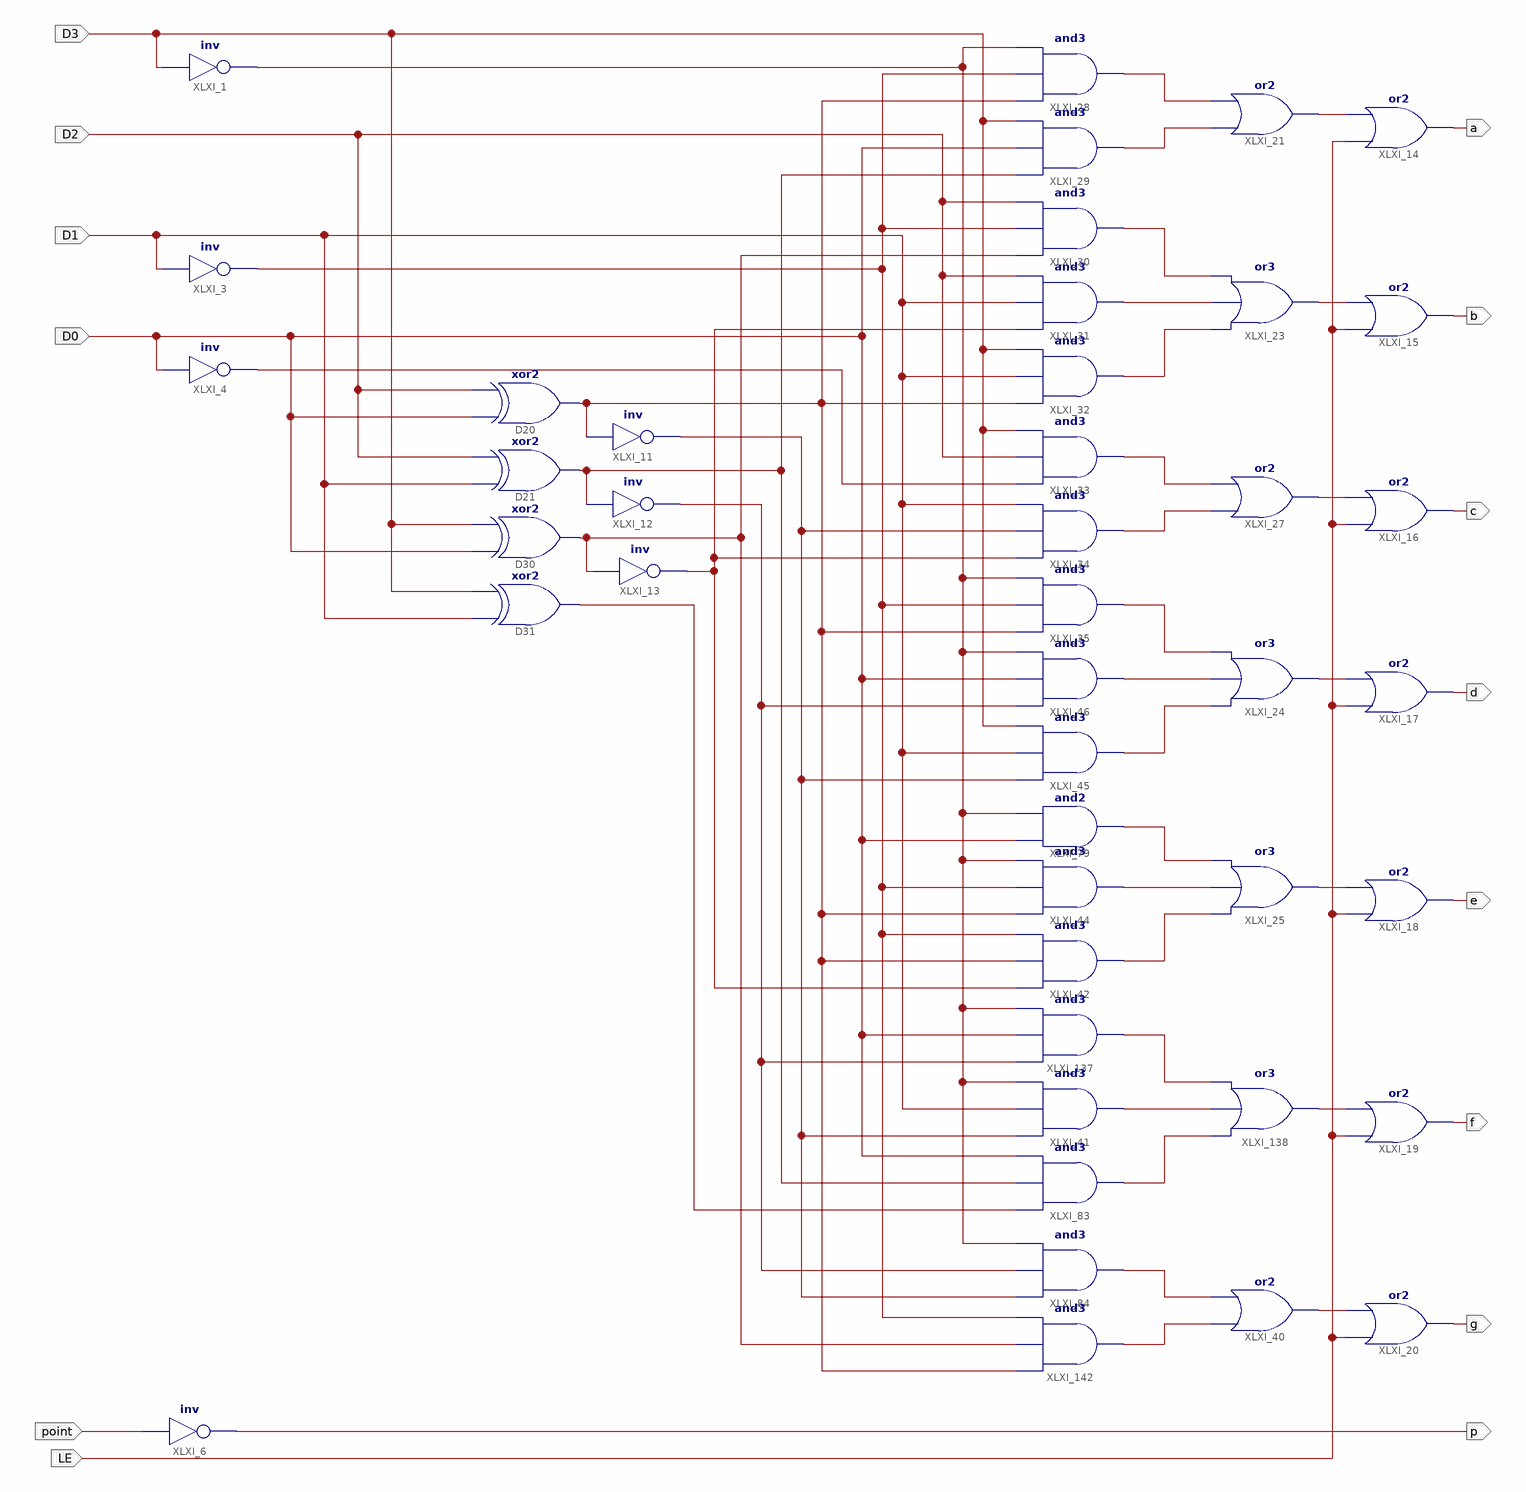
[diagram p0: schematic sheet 1]
// Xilinx ISE schematic MC14495_ZJU.sch (kintex7) as structural Verilog: 43 symbols, 14 ports
module MC14495_ZJU (
  input  D3,
  input  D2,
  input  D0,
  input  point,
  input  LE,
  input  D1,
  output p,
  output b,
  output a,
  output c,
  output d,
  output e,
  output f,
  output g
);

  wire XLXN_22, XLXN_24, XLXN_29, XLXN_31, XLXN_32, XLXN_33, XLXN_35, XLXN_36, XLXN_47, XLXN_48, XLXN_49,
       XLXN_50, XLXN_51, XLXN_68, XLXN_115, XLXN_121, XLXN_122, XLXN_123, XLXN_124, XLXN_125, XLXN_126,
       XLXN_127, XLXN_128, XLXN_129, XLXN_130, XLXN_131, XLXN_133, XLXN_134, XLXN_135, XLXN_136, XLXN_137,
       XLXN_138, XLXN_139, XLXN_160, XLXN_164;

  not XLXI_1 (XLXN_24, D3);
  not XLXI_4 (XLXN_164, D0);
  not XLXI_3 (XLXN_22, D1);
  xor D20 (XLXN_36, D0, D2);
  xor D21 (XLXN_35, D1, D2);
  xor D30 (XLXN_31, D0, D3);
  xor D31 (XLXN_29, D1, D3);
  not XLXI_11 (XLXN_160, XLXN_36);
  not XLXI_12 (XLXN_33, XLXN_35);
  not XLXI_13 (XLXN_32, XLXN_31);
  not XLXI_6 (p, point);
  and XLXI_41 (XLXN_136, XLXN_160, D1, XLXN_24);
  and XLXI_83 (XLXN_137, XLXN_29, XLXN_35, D0);
  and XLXI_84 (XLXN_138, XLXN_160, XLXN_33, XLXN_24);
  and XLXI_28 (XLXN_121, XLXN_36, XLXN_22, XLXN_24);
  and XLXI_29 (XLXN_122, XLXN_35, D0, D3);
  and XLXI_31 (XLXN_123, XLXN_32, D1, D2);
  and XLXI_32 (XLXN_124, XLXN_36, D1, D3);
  and XLXI_30 (XLXN_125, XLXN_31, XLXN_22, D2);
  and XLXI_33 (XLXN_126, XLXN_164, D2, D3);
  and XLXI_34 (XLXN_127, XLXN_32, XLXN_160, D1);
  and XLXI_35 (XLXN_128, XLXN_36, XLXN_22, XLXN_24);
  and XLXI_46 (XLXN_129, XLXN_33, D0, XLXN_24);
  and XLXI_45 (XLXN_130, XLXN_160, D1, D3);
  or XLXI_15 (b, LE, XLXN_48);
  or XLXI_23 (XLXN_48, XLXN_124, XLXN_123, XLXN_125);
  or XLXI_14 (a, LE, XLXN_47);
  or XLXI_21 (XLXN_47, XLXN_122, XLXN_121);
  or XLXI_16 (c, LE, XLXN_49);
  or XLXI_27 (XLXN_49, XLXN_127, XLXN_126);
  or XLXI_17 (d, LE, XLXN_50);
  or XLXI_24 (XLXN_50, XLXN_130, XLXN_129, XLXN_128);
  and XLXI_42 (XLXN_134, XLXN_32, XLXN_36, XLXN_22);
  and XLXI_44 (XLXN_133, XLXN_36, XLXN_22, XLXN_24);
  and XLXI_79 (XLXN_131, D0, XLXN_24);
  or XLXI_18 (e, LE, XLXN_51);
  or XLXI_25 (XLXN_51, XLXN_134, XLXN_133, XLXN_131);
  and XLXI_137 (XLXN_135, XLXN_33, D0, XLXN_24);
  or XLXI_138 (XLXN_115, XLXN_137, XLXN_136, XLXN_135);
  or XLXI_19 (f, LE, XLXN_115);
  and XLXI_142 (XLXN_139, XLXN_36, XLXN_31, XLXN_22);
  or XLXI_20 (g, LE, XLXN_68);
  or XLXI_40 (XLXN_68, XLXN_139, XLXN_138);
endmodule
